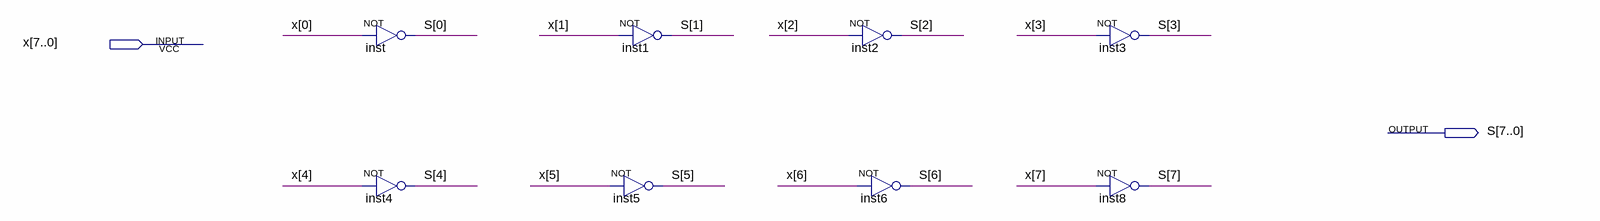
[diagram p0: schematic sheet]
// Quartus schematic NOT_ULA.bdf as structural Verilog: 8 symbols, 2 pins
module NOT_ULA (
  input  [7:0] x,
  output [7:0] S
);

  not inst (S[0], x[0]);
  not inst4 (S[4], x[4]);
  not inst5 (S[5], x[5]);
  not inst1 (S[1], x[1]);
  not inst2 (S[2], x[2]);
  not inst6 (S[6], x[6]);
  not inst3 (S[3], x[3]);
  not inst8 (S[7], x[7]);
endmodule
